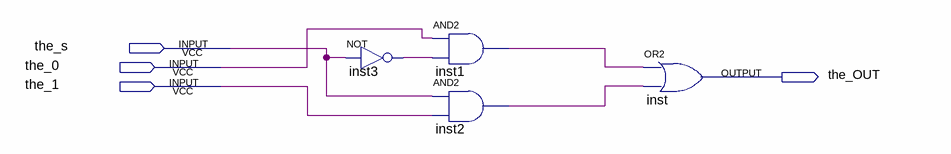
[diagram p0: schematic sheet]
// Quartus schematic the_mux.bdf as structural Verilog: 4 symbols, 4 pins
module the_mux (
  input  the_s,
  input  the_0,
  input  the_1,
  output the_OUT
);

  wire inst1_out, inst2_out, inst3_out;

  not inst3 (inst3_out, the_s);
  and inst1 (inst1_out, the_0, inst3_out);
  and inst2 (inst2_out, the_s, the_1);
  or inst (the_OUT, inst1_out, inst2_out);
endmodule
